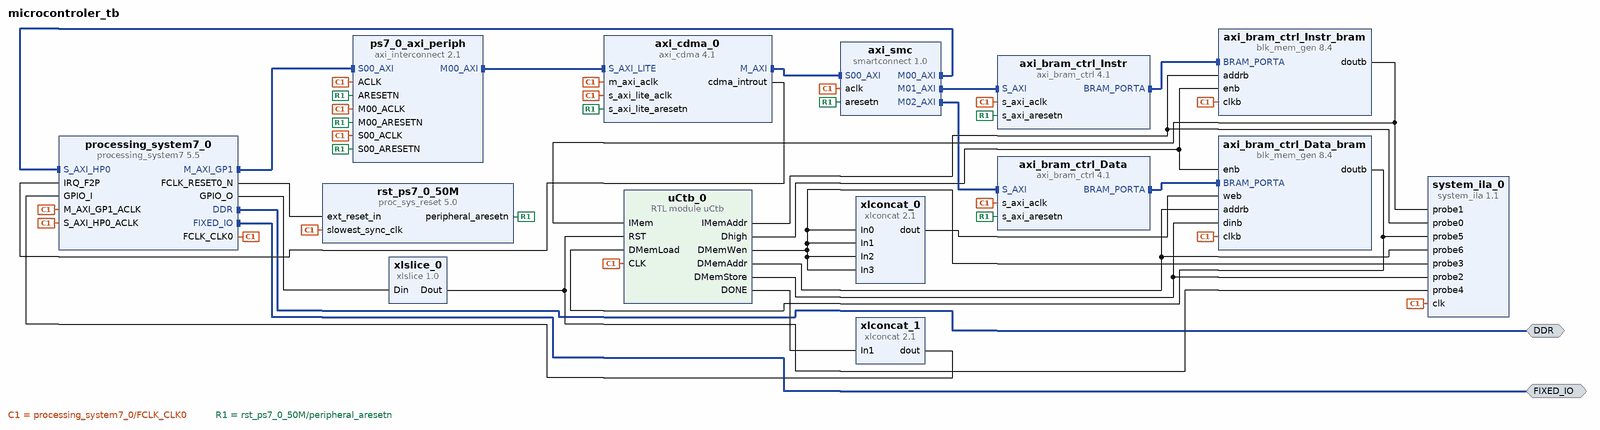
[diagram p0: block diagram of the top level]
# Vivado block design microcontroler_tb, xc7z010clg400-1, Vivado 2018.3
create_bd_design microcontroler_tb

create_bd_intf_port -mode Master -vlnv xilinx.com:interface:ddrx_rtl:1.0 DDR
create_bd_intf_port -mode Master -vlnv xilinx.com:display_processing_system7:fixedio_rtl:1.0 FIXED_IO

create_bd_cell -type ip -vlnv xilinx.com:ip:axi_cdma:4.1 axi_cdma_0
set_property -dict {CONFIG.C_INCLUDE_SG 0} [get_bd_cells axi_cdma_0]
create_bd_cell -type ip -vlnv xilinx.com:ip:processing_system7:5.5 processing_system7_0
set_property -dict [list \
  CONFIG.PCW_APU_PERIPHERAL_FREQMHZ 666.666666 \
  CONFIG.PCW_ENET0_PERIPHERAL_ENABLE 0 \
  CONFIG.PCW_FPGA0_PERIPHERAL_FREQMHZ 50 \
  CONFIG.PCW_FPGA1_PERIPHERAL_FREQMHZ 50 \
  CONFIG.PCW_GPIO_EMIO_GPIO_ENABLE 1 \
  CONFIG.PCW_GPIO_EMIO_GPIO_IO 2 \
  CONFIG.PCW_GPIO_EMIO_GPIO_WIDTH 2 \
  CONFIG.PCW_GPIO_MIO_GPIO_ENABLE 1 \
  CONFIG.PCW_GPIO_MIO_GPIO_IO MIO \
  CONFIG.PCW_I2C_RESET_ENABLE 1 \
  CONFIG.PCW_IRQ_F2P_INTR 1 \
  CONFIG.PCW_PERIPHERAL_BOARD_PRESET None \
  CONFIG.PCW_PRESET_BANK1_VOLTAGE {LVCMOS 3.3V} \
  CONFIG.PCW_QSPI_PERIPHERAL_ENABLE 0 \
  CONFIG.PCW_SD0_PERIPHERAL_ENABLE 0 \
  CONFIG.PCW_UART0_PERIPHERAL_ENABLE 1 \
  CONFIG.PCW_UART0_UART0_IO {MIO 14 .. 15} \
  CONFIG.PCW_UART1_PERIPHERAL_ENABLE 0 \
  CONFIG.PCW_UART_PERIPHERAL_FREQMHZ 100 \
  CONFIG.PCW_UIPARAM_DDR_BUS_WIDTH {16 Bit} \
  CONFIG.PCW_UIPARAM_DDR_FREQ_MHZ 533.333333 \
  CONFIG.PCW_UIPARAM_DDR_PARTNO {MT41J256M16 RE-125} \
  CONFIG.PCW_USB0_PERIPHERAL_ENABLE 0 \
  CONFIG.PCW_USB_RESET_ENABLE 1 \
  CONFIG.PCW_USE_FABRIC_INTERRUPT 1 \
  CONFIG.PCW_USE_M_AXI_GP0 0 \
  CONFIG.PCW_USE_M_AXI_GP1 1 \
  CONFIG.PCW_USE_S_AXI_HP0 1 \
] [get_bd_cells processing_system7_0]
# 493 more settings of processing_system7_0 are not shown: defaults, MIO pin electricals, DDR timing, and values the tool derives
create_bd_cell -type ip -vlnv xilinx.com:ip:axi_bram_ctrl:4.1 axi_bram_ctrl_Instr
set_property -dict {CONFIG.SINGLE_PORT_BRAM 1} [get_bd_cells axi_bram_ctrl_Instr]
create_bd_cell -type ip -vlnv xilinx.com:ip:axi_bram_ctrl:4.1 axi_bram_ctrl_Data
set_property -dict {CONFIG.SINGLE_PORT_BRAM 1} [get_bd_cells axi_bram_ctrl_Data]
create_bd_cell -type ip -vlnv xilinx.com:ip:proc_sys_reset:5.0 rst_ps7_0_50M
create_bd_cell -type ip -vlnv xilinx.com:ip:blk_mem_gen:8.4 axi_bram_ctrl_Instr_bram
set_property -dict {CONFIG.EN_SAFETY_CKT false CONFIG.Memory_Type True_Dual_Port_RAM} [get_bd_cells axi_bram_ctrl_Instr_bram]
create_bd_cell -type ip -vlnv xilinx.com:ip:blk_mem_gen:8.4 axi_bram_ctrl_Data_bram
set_property -dict {CONFIG.EN_SAFETY_CKT false CONFIG.Memory_Type True_Dual_Port_RAM} [get_bd_cells axi_bram_ctrl_Data_bram]
create_bd_cell -type ip -vlnv xilinx.com:ip:xlconcat:2.1 xlconcat_0
set_property -dict {CONFIG.NUM_PORTS 4} [get_bd_cells xlconcat_0]
create_bd_cell -type ip -vlnv xilinx.com:ip:xlconcat:2.1 xlconcat_1
set_property -dict {CONFIG.NUM_PORTS 2} [get_bd_cells xlconcat_1]
create_bd_cell -type ip -vlnv xilinx.com:ip:xlslice:1.0 xlslice_0
set_property -dict {CONFIG.DIN_FROM 0 CONFIG.DIN_TO 0 CONFIG.DIN_WIDTH 2} [get_bd_cells xlslice_0]
create_bd_cell -type ip -vlnv xilinx.com:ip:axi_interconnect:2.1 ps7_0_axi_periph
set_property -dict {CONFIG.NUM_MI 1} [get_bd_cells ps7_0_axi_periph]
create_bd_cell -type ip -vlnv xilinx.com:ip:smartconnect:1.0 axi_smc
set_property -dict {CONFIG.NUM_MI 3 CONFIG.NUM_SI 1} [get_bd_cells axi_smc]
create_bd_cell -type ip -vlnv xilinx.com:ip:system_ila:1.1 system_ila_0
set_property -dict [list \
  CONFIG.C_MON_TYPE NATIVE \
  CONFIG.C_NUM_OF_PROBES 7 \
  CONFIG.C_PROBE0_TYPE 0 \
  CONFIG.C_PROBE1_TYPE 0 \
  CONFIG.C_PROBE2_TYPE 0 \
  CONFIG.C_PROBE3_TYPE 0 \
  CONFIG.C_PROBE4_TYPE 0 \
  CONFIG.C_PROBE5_TYPE 0 \
  CONFIG.C_PROBE6_TYPE 0 \
] [get_bd_cells system_ila_0]
create_bd_cell -type module -reference uCtb uCtb_0

# ---- connections ----

connect_bd_intf_net [get_bd_intf_ports DDR] [get_bd_intf_pins processing_system7_0/DDR]
connect_bd_intf_net [get_bd_intf_pins axi_smc/M02_AXI] [get_bd_intf_pins axi_bram_ctrl_Data/S_AXI]
connect_bd_intf_net [get_bd_intf_ports FIXED_IO] [get_bd_intf_pins processing_system7_0/FIXED_IO]
connect_bd_intf_net [get_bd_intf_pins processing_system7_0/M_AXI_GP1] [get_bd_intf_pins ps7_0_axi_periph/S00_AXI]
connect_bd_intf_net [get_bd_intf_pins axi_bram_ctrl_Data_bram/BRAM_PORTA] [get_bd_intf_pins axi_bram_ctrl_Data/BRAM_PORTA]
connect_bd_intf_net [get_bd_intf_pins axi_smc/M01_AXI] [get_bd_intf_pins axi_bram_ctrl_Instr/S_AXI]
connect_bd_intf_net [get_bd_intf_pins axi_bram_ctrl_Instr_bram/BRAM_PORTA] [get_bd_intf_pins axi_bram_ctrl_Instr/BRAM_PORTA]
connect_bd_intf_net [get_bd_intf_pins axi_smc/M00_AXI] [get_bd_intf_pins processing_system7_0/S_AXI_HP0]
connect_bd_intf_net [get_bd_intf_pins axi_cdma_0/M_AXI] [get_bd_intf_pins axi_smc/S00_AXI]
connect_bd_intf_net [get_bd_intf_pins ps7_0_axi_periph/M00_AXI] [get_bd_intf_pins axi_cdma_0/S_AXI_LITE]
connect_bd_net [get_bd_pins processing_system7_0/FCLK_CLK0] \
  [get_bd_pins rst_ps7_0_50M/slowest_sync_clk] [get_bd_pins processing_system7_0/M_AXI_GP1_ACLK] \
  [get_bd_pins axi_cdma_0/s_axi_lite_aclk] [get_bd_pins axi_cdma_0/m_axi_aclk] \
  [get_bd_pins processing_system7_0/S_AXI_HP0_ACLK] [get_bd_pins axi_bram_ctrl_Instr/s_axi_aclk] \
  [get_bd_pins axi_bram_ctrl_Data/s_axi_aclk] [get_bd_pins axi_bram_ctrl_Instr_bram/clkb] \
  [get_bd_pins axi_bram_ctrl_Data_bram/clkb] [get_bd_pins ps7_0_axi_periph/ACLK] [get_bd_pins ps7_0_axi_periph/S00_ACLK] \
  [get_bd_pins ps7_0_axi_periph/M00_ACLK] [get_bd_pins axi_smc/aclk] [get_bd_pins system_ila_0/clk] [get_bd_pins uCtb_0/CLK]
connect_bd_net [get_bd_pins processing_system7_0/FCLK_RESET0_N] [get_bd_pins rst_ps7_0_50M/ext_reset_in]
connect_bd_net [get_bd_pins rst_ps7_0_50M/peripheral_aresetn] \
  [get_bd_pins axi_cdma_0/s_axi_lite_aresetn] [get_bd_pins axi_bram_ctrl_Instr/s_axi_aresetn] \
  [get_bd_pins axi_bram_ctrl_Data/s_axi_aresetn] [get_bd_pins ps7_0_axi_periph/S00_ARESETN] \
  [get_bd_pins ps7_0_axi_periph/M00_ARESETN] [get_bd_pins ps7_0_axi_periph/ARESETN] [get_bd_pins axi_smc/aresetn]
connect_bd_net [get_bd_pins axi_cdma_0/cdma_introut] [get_bd_pins processing_system7_0/IRQ_F2P]
connect_bd_net -net uCtb_0_IMemAddr [get_bd_pins uCtb_0/IMemAddr] [get_bd_pins axi_bram_ctrl_Instr_bram/addrb] [get_bd_pins system_ila_0/probe0]
connect_bd_net -net axi_bram_ctrl_Instr_bram_doutb [get_bd_pins axi_bram_ctrl_Instr_bram/doutb] \
  [get_bd_pins system_ila_0/probe1] [get_bd_pins uCtb_0/IMem]
connect_bd_net [get_bd_pins uCtb_0/Dhigh] [get_bd_pins axi_bram_ctrl_Instr_bram/enb] [get_bd_pins axi_bram_ctrl_Data_bram/enb]
connect_bd_net -net axi_bram_ctrl_Data_bram_doutb [get_bd_pins axi_bram_ctrl_Data_bram/doutb] \
  [get_bd_pins system_ila_0/probe5] [get_bd_pins uCtb_0/DMemLoad]
connect_bd_net -net uCtb_0_DMemAddr [get_bd_pins uCtb_0/DMemAddr] [get_bd_pins axi_bram_ctrl_Data_bram/addrb] [get_bd_pins system_ila_0/probe6]
connect_bd_net -net uCtb_0_DMemStore [get_bd_pins uCtb_0/DMemStore] [get_bd_pins axi_bram_ctrl_Data_bram/dinb] [get_bd_pins system_ila_0/probe2]
connect_bd_net [get_bd_pins xlconcat_0/dout] [get_bd_pins axi_bram_ctrl_Data_bram/web]
connect_bd_net -net uCtb_0_DMemWen [get_bd_pins uCtb_0/DMemWen] \
  [get_bd_pins xlconcat_0/In0] [get_bd_pins xlconcat_0/In1] [get_bd_pins xlconcat_0/In2] [get_bd_pins xlconcat_0/In3] \
  [get_bd_pins system_ila_0/probe3]
connect_bd_net [get_bd_pins xlconcat_1/dout] [get_bd_pins processing_system7_0/GPIO_I]
connect_bd_net [get_bd_pins uCtb_0/DONE] [get_bd_pins xlconcat_1/In1]
connect_bd_net [get_bd_pins processing_system7_0/GPIO_O] [get_bd_pins xlslice_0/Din]
connect_bd_net -net xlslice_0_Dout [get_bd_pins xlslice_0/Dout] [get_bd_pins system_ila_0/probe4] [get_bd_pins uCtb_0/RST]
set_property HDL_ATTRIBUTE.BMM_INFO_PROCESSOR {arm > microcontroler_tb axi_bram_ctrl_Instr microcontroler_tb axi_bram_ctrl_Data} [get_bd_cells processing_system7_0]
set_property HDL_ATTRIBUTE.KEEP_HIERARCHY yes [get_bd_cells processing_system7_0]
set_property HDL_ATTRIBUTE.BMM_INFO_ADDRESS_SPACE {byte  0x80000000 32 > microcontroler_tb axi_bram_ctrl_Instr_bram} [get_bd_cells axi_bram_ctrl_Instr]
set_property HDL_ATTRIBUTE.KEEP_HIERARCHY yes [get_bd_cells axi_bram_ctrl_Instr]
set_property HDL_ATTRIBUTE.BMM_INFO_ADDRESS_SPACE {byte  0x82000000 32 > microcontroler_tb axi_bram_ctrl_Data_bram} [get_bd_cells axi_bram_ctrl_Data]
set_property HDL_ATTRIBUTE.KEEP_HIERARCHY yes [get_bd_cells axi_bram_ctrl_Data]
set_property HDL_ATTRIBUTE.DEBUG true [get_bd_nets uCtb_0_IMemAddr]
set_property HDL_ATTRIBUTE.MARK_DEBUG true [get_bd_nets uCtb_0_IMemAddr]
set_property HDL_ATTRIBUTE.DEBUG true [get_bd_nets axi_bram_ctrl_Instr_bram_doutb]
set_property HDL_ATTRIBUTE.MARK_DEBUG true [get_bd_nets axi_bram_ctrl_Instr_bram_doutb]
set_property HDL_ATTRIBUTE.DEBUG true [get_bd_nets axi_bram_ctrl_Data_bram_doutb]
set_property HDL_ATTRIBUTE.MARK_DEBUG true [get_bd_nets axi_bram_ctrl_Data_bram_doutb]
set_property HDL_ATTRIBUTE.DEBUG true [get_bd_nets uCtb_0_DMemAddr]
set_property HDL_ATTRIBUTE.MARK_DEBUG true [get_bd_nets uCtb_0_DMemAddr]
set_property HDL_ATTRIBUTE.DEBUG true [get_bd_nets uCtb_0_DMemStore]
set_property HDL_ATTRIBUTE.MARK_DEBUG true [get_bd_nets uCtb_0_DMemStore]
set_property HDL_ATTRIBUTE.DEBUG true [get_bd_nets uCtb_0_DMemWen]
set_property HDL_ATTRIBUTE.MARK_DEBUG true [get_bd_nets uCtb_0_DMemWen]
set_property HDL_ATTRIBUTE.DEBUG true [get_bd_nets xlslice_0_Dout]
set_property HDL_ATTRIBUTE.MARK_DEBUG true [get_bd_nets xlslice_0_Dout]

# ---- address map ----
assign_bd_address -offset 0x00000000 -range 512M -target_address_space [get_bd_addr_spaces axi_cdma_0/Data] [get_bd_addr_segs processing_system7_0/S_AXI_HP0/HP0_DDR_LOWOCM]
assign_bd_address -offset 0x80000000 -range 32K -target_address_space [get_bd_addr_spaces axi_cdma_0/Data] [get_bd_addr_segs axi_bram_ctrl_Instr/S_AXI/Mem0]
assign_bd_address -offset 0x82000000 -range 32K -target_address_space [get_bd_addr_spaces axi_cdma_0/Data] [get_bd_addr_segs axi_bram_ctrl_Data/S_AXI/Mem0]
assign_bd_address -offset 0x8E200000 -range 64K -target_address_space [get_bd_addr_spaces processing_system7_0/Data] [get_bd_addr_segs axi_cdma_0/S_AXI_LITE/Reg]

validate_bd_design
save_bd_design
